# EasyEDA schematic SCH_Orcon MV Control_2023-08-23.json
TITLE: Orcon MV Control; REV: 1.0; Date: 2023-07-10; Sheet: 1/1; Drawn By: bonno; Company: Tinuvion
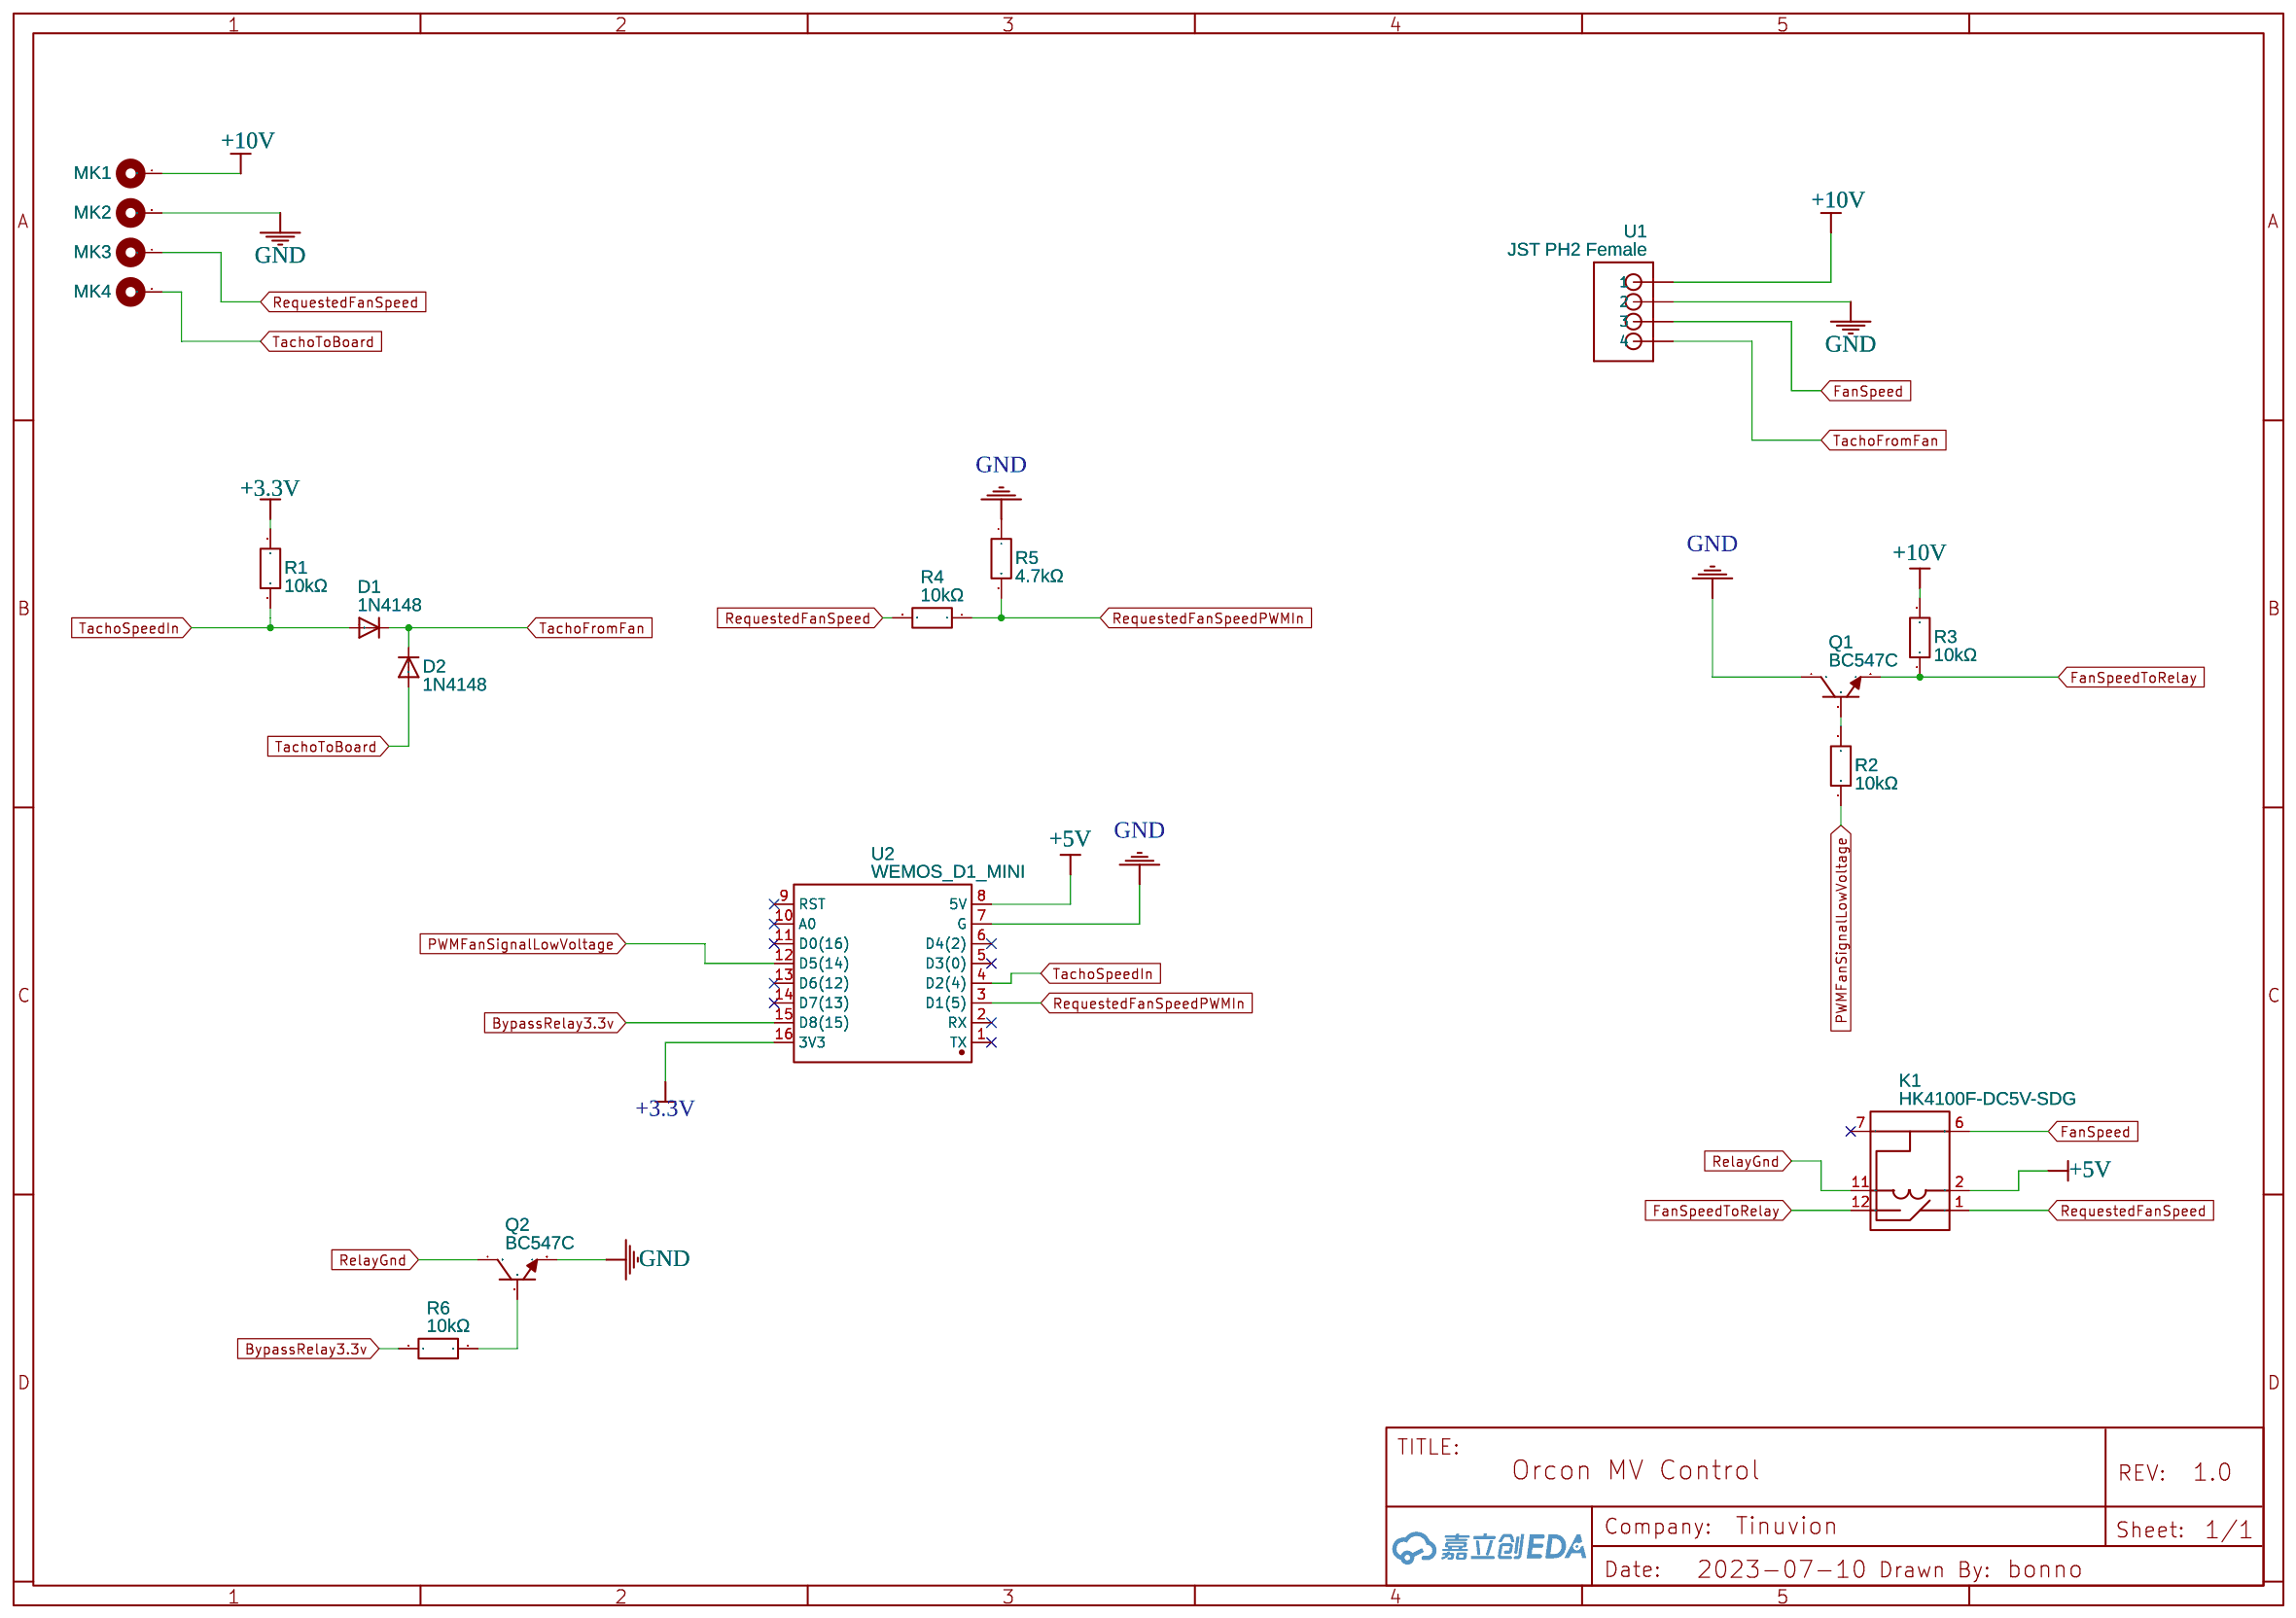
[diagram p0: schematic sheet]

## Parts
D1  1N4148  [DIODE-1N4148]
D2  1N4148  [DIODE-1N4148]
K1  HK4100F-DC5V-SDG  [RELAY-TH_HK4100F-DC5V-SDG]
MK1  Mounting_Hole_PAD  [PAD-THT-C050]
MK2  Mounting_Hole_PAD  [PAD-THT-C050]
MK3  Mounting_Hole_PAD  [PAD-THT-C050]
MK4  Mounting_Hole_PAD  [PAD-THT-C050]
Q1  BC547C  [TO-92-3_L4.9-W3.7-P1.27-L]
Q2  BC547C  [TO-92-3_L4.9-W3.7-P1.27-L]
R1  10kΩ  [R0603]
R2  10kΩ  [R0603]
R3  10kΩ  [R0603]
R4  10kΩ  [R0603]
R5  4.7kΩ  [R0603]
R6  10kΩ  [R0603]
U1  JST PH2 Female  [JST_B4B-PH_HEADER]
U2  WEMOS_D1_MINI  [DIP-16_WEMOS_D1_MINI_PRO4]

## Library data of the parts
D1 D2 = DIODE: Contributor: SparkFun; Supplier: LCSC; Manufacturer: ST(先科); Supplier Part: C14516
K1 = HK4100F-DC5V-SDG: Contributor: LCSC; Supplier: LCSC; Supplier Part: C185866; Manufacturer: 汇科; JLCPCB Part Class: Extended Part; link: https://lcsc.com/eda_search?q=C185866&%26type=1&ref=editor
MK1-MK4 = Mounting_Hole_PAD: Contributor: KiCAD; license: https://www.gnu.org/licenses/lgpl-2.1.html
Q1 Q2 = BC547C: Contributor: LCSC; Supplier: LCSC; Supplier Part: C713614; Manufacturer: LGE; JLCPCB Part Class: Extended Part; link: https://lcsc.com/eda_search?q=C713614&%26type=1&ref=editor
R1-R4 R6 = R_0603_EU: Supplier Part: C2992491; Supplier: LCSC; Contributor: LCEDA_Lib; Manufacturer Part: AR03BTD1002; Manufacturer: Viking(光颉)
R5 = R_0603_EU: Supplier Part: C2918626; Supplier: LCSC; Contributor: LCEDA_Lib; Manufacturer Part: MR08X472 JTL; Manufacturer: Walsin(华新科)
U1 = JST-PH_4-PIN_HEADER
U2 = WEMOS_D1_MINI_PRO4: Contributor: LCSC; Supplier: LCSC; Supplier Part: C2837266; Manufacturer: null; Manufacturer Part: Wemos_D1_mini_Pro4; JLCPCB Part Class: Extended Part; link: https://lcsc.com/eda_search?q=C2837266&%26type=1&ref=editor

## Nets
+3.3V: R1.2 U2.16(3V3)
+5V: K1.2 U2.8(5V)
+10V: MK1.1 R3.2 U1.P1(1)
GND: MK2.1 Q1.1(C) Q2.3(E) R5.1 U1.P2(2) U2.7(G)
BypassRelay3.3v: R6.2 U2.15(D8(15))
FanSpeed: K1.6 U1.P3(3)
FanSpeedToRelay: K1.12 Q1.3(E) R3.1
PWMFanSignalLowVoltage: R2.1 U2.12(D5(14))
RelayGnd: K1.11 Q2.1(C)
RequestedFanSpeed: K1.1 MK3.1 R4.2
RequestedFanSpeedPWMIn: R4.1 R5.2 U2.3(D1(5))
TachoFromFan: D1.C D2.C U1.P4(4)
TachoSpeedIn: D1.A R1.1 U2.4(D2(4))
TachoToBoard: D2.A MK4.1
Net-(Q1-2): Q1.2(B) R2.2
Net-(Q2-2): Q2.2(B) R6.1

Not connected (* = marked no-connect by the designer): K1 7*; U2 1(TX)* 2(RX)* 5(D3(0))* 6(D4(2))* 9(RST)* 10(A0)* 11(D0(16))* 13(D6(12))* 14(D7(13))*
